# Altium schematic sheet 4.2寸墨水屏-兼容甘草酸不酸_2024-11-22.schdoc
size 344 x 241 mm
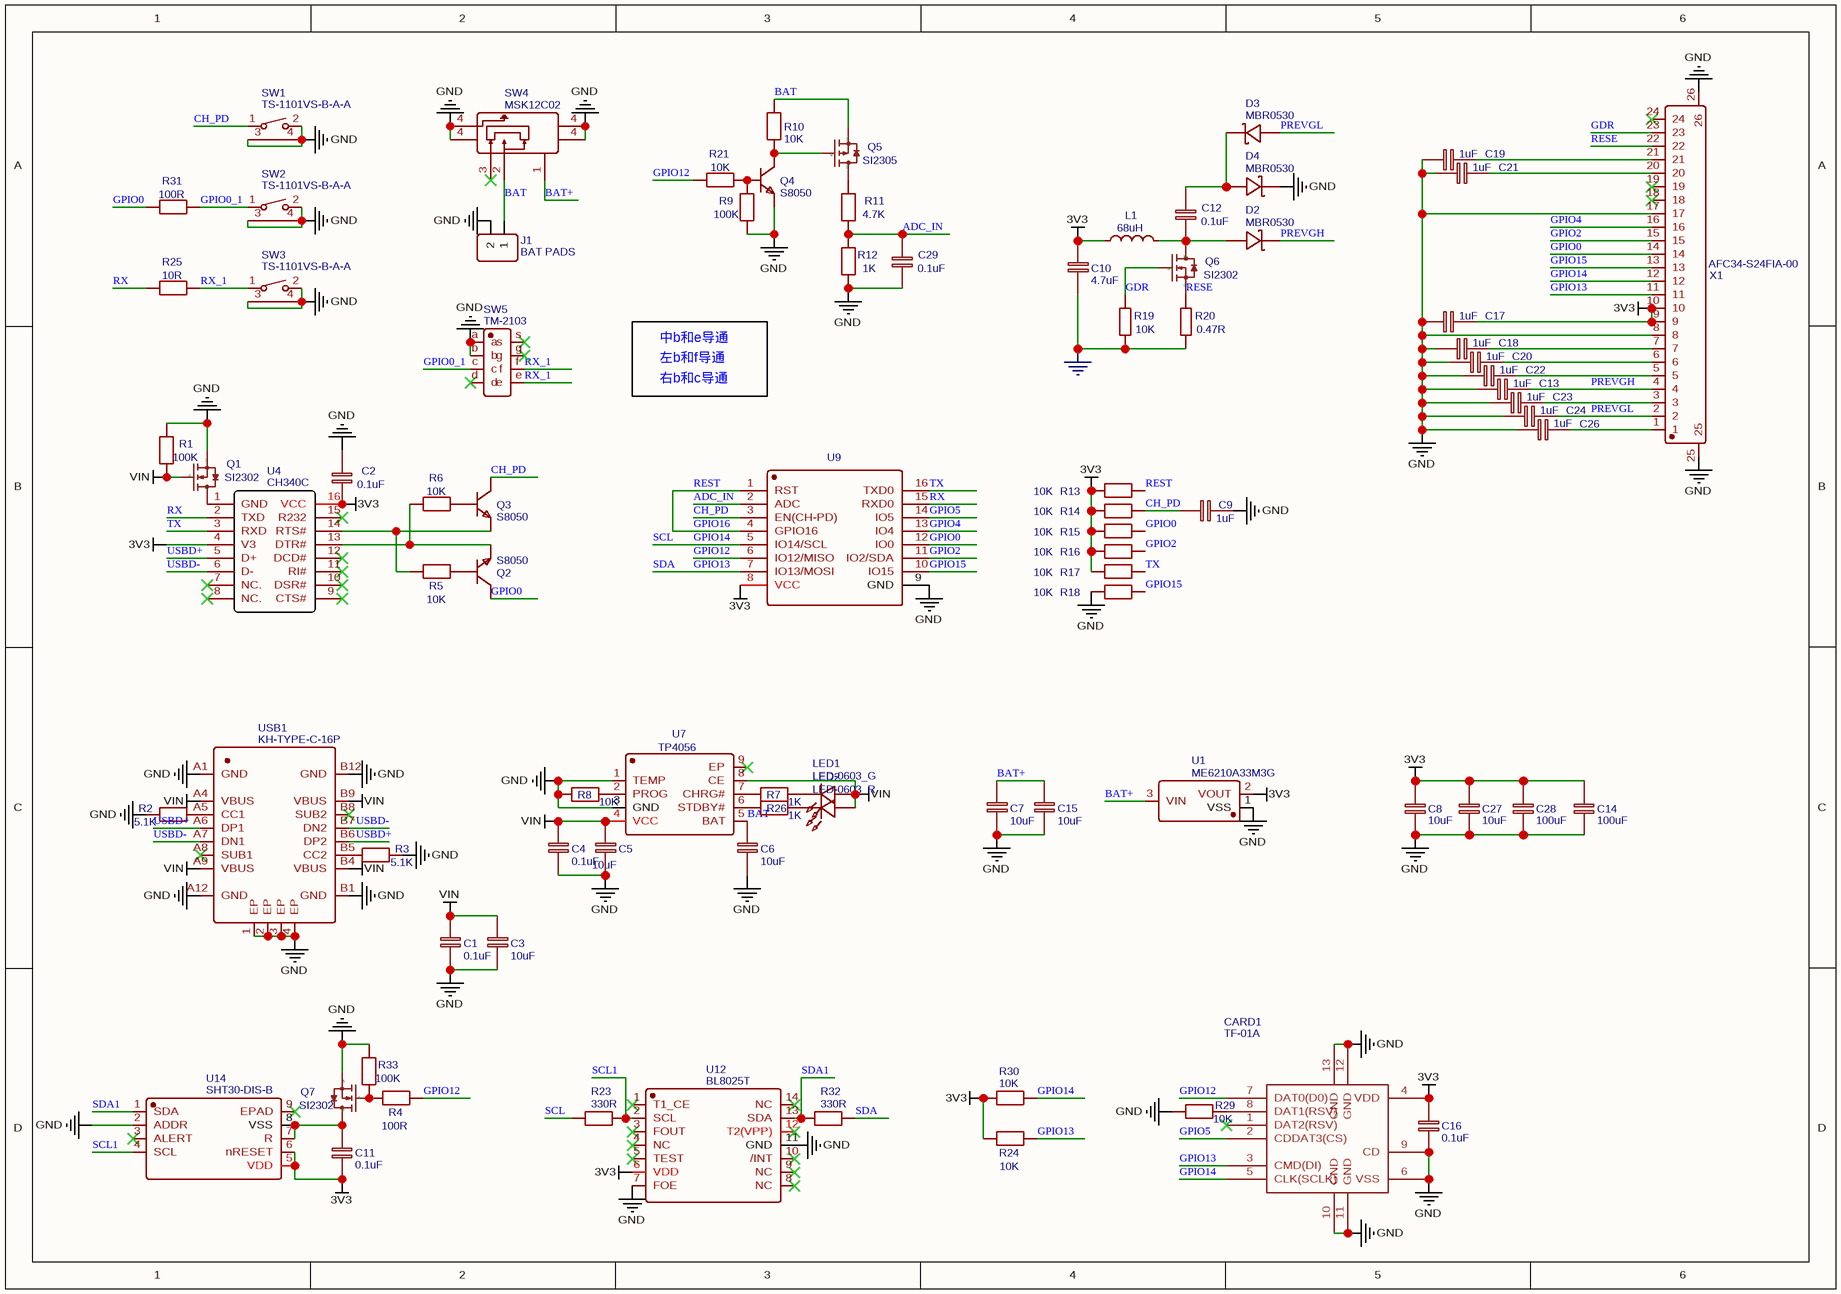
[diagram p0: 4.2寸墨水屏-兼容甘草酸不酸_2024-11-22.schdoc]

## Parts
C1  0.1uF  [C0603]
C2  0.1uF  [C0603]
C3  10uF  [C0603]
C4  0.1uF  [C0603]
C5  10uF  [C0603]
C6  10uF  [C0603]
C7  10uF  [C0603]
C8  10uF  [C0603]
C9  1uF  [C0603]
C10  4.7uF  [C0603]
C11  0.1uF  [C0603]
C12  0.1uF  [C0603]
C13  1uF  [C0603]
C14  100uF  [C1210]
C15  10uF  [C0603]
C16  0.1uF  [C0603]
C17  1uF  [C0603]
C18  1uF  [C0603]
C19  1uF  [C0603]
C20  1uF  [C0603]
C21  1uF  [C0603]
C22  1uF  [C0603]
C23  1uF  [C0603]
C24  1uF  [C0603]
C26  1uF  [C0603]
C27  10uF  [C0603]
C28  100uF  [C1210]
C29  0.1uF  [C0603]
CARD1  TF-01A  [TF-SMD_TF-01A]
D2  MBR0530  [SOD-123]
D3  MBR0530  [SOD-123]
D4  MBR0530  [SOD-123]
J1  BAT PADS  [HDR-F-2.54_1X2]
L1  68uH  [IND-SMD_L3.5-W3.0]
LED1  LED-0603_G  [LED0603_GREEN]
LED2  LED-0603_R  [LED0603_RED]
Q1  SI2302  [SOT-23(SOT-23-3)]
Q2  S8050  [SOT-23-3_L3.0-W1.7-P0.95-LS2.9-BR]
Q3  S8050  [SOT-23-3_L3.0-W1.7-P0.95-LS2.9-BR]
Q4  S8050  [SOT-23-3_L3.0-W1.7-P0.95-LS2.9-BR]
Q5  SI2305  [SOT-23-3_L2.9-W1.3-P1.90-LS2.4-BR]
Q6  SI2302  [SOT-23(SOT-23-3)]
Q7  SI2302  [SOT-23(SOT-23-3)]
R1  100K  [R0603]
R2  5.1K  [R0603]
R3  5.1K  [R0603]
R4  100R  [R0603]
R5  10K  [R0603]
R6  10K  [R0603]
R7  1K  [R0603]
R8  10K  [R0603]
R9  100K  [R0603]
R10  10K  [R0603]
R11  4.7K  [R0603]
R12  1K  [R0603]
R13  10K  [R0603]
R14  10K  [R0603]
R15  10K  [R0603]
R16  10K  [R0603]
R17  10K  [R0603]
R18  10K  [R0603]
R19  10K  [R0603]
R20  0.47R  [R0603]
R21  10K  [R0603]
R23  330R  [R0603]
R24  10K  [R0603]
R25  10R  [R0603]
R26  1K  [R0603]
R29  10K  [R0603]
R30  10K  [R0603]
R31  100R  [R0603]
R32  330R  [R0603]
R33  100K  [R0603]
SW1  TS-1101VS-B-A-A  [SW-SMD_TS-1101VS-C-A-B]
SW2  TS-1101VS-B-A-A  [SW-SMD_TS-1101VS-C-A-B]
SW3  TS-1101VS-B-A-A  [SW-SMD_TS-1101VS-C-A-B]
SW4  MSK12C02  [SW-TH_MSK12C02]
SW5  TM-2103  [SW-SMD_TM-2103]
U1  ME6210A33M3G  [SOT-23-3_L3.0-W1.7-P0.95-LS2.9-BR]
U4  CH340C  [SOP-16_L10.0-W3.9-P1.27-LS6.0-BL]
U7  TP4056  [ESOP-8_L4.9-W3.9-P1.27-LS6.0-BL-EP]
U9  ESP8266模组标注版  [ESP-12]  (value not drawn)
U12  BL8025T  [SOP-14_L10.3-W5.3-P1.27-LS7.8-BL]
U14  SHT30-DIS-B  [DFN-8_L2.5-W2.5-P0.50-BL-EP]
USB1  KH-TYPE-C-16P  [USB-C-SMD_KH-TYPE-C-16P]
X1  AFC34-S24FIA-00  [FPC-SMD_AFC34-S24FIA-00]

## Nets
3V3: C2.1 C8.2 C10.1 C11.1 C14.2 C16.2 C17.2 C27.2 C28.2 CARD1.4(VDD) L1.1 R13.1 R14.1 R15.1 R16.1 R17.1 R24.2 R30.2 U1.2(VOUT) U4.4(V3) U4.16(VCC) U9.8(VCC) U12.6(VDD) U14.5(VDD) U14.6(nRESET) X1.9 X1.10
GND: C1.2 C2.2 C3.2 C4.2 C5.2 C6.2 C7.2 C8.1 C9.2 C10.2 C13.1 C14.1 C15.2 C16.1 C17.1 C18.1 C19.1 C20.1 C21.1 C22.1 C23.1 C24.1 C26.1 C27.1 C28.1 C29.1 CARD1.6(VSS) CARD1.9(CD) CARD1.10(GND) CARD1.11(GND) CARD1.12(GND) CARD1.13(GND) D4.2(K) J1.2 Q1.2(S) Q4.2(E) Q7.2(S) R1.2 R2.1 R3.2 R8.1 R9.1 R12.1 R18.1 R19.1 R20.1 R29.1 R33.2 SW1.2 SW1.3 SW1.4 SW2.2 SW2.3 SW2.4 SW3.2 SW3.3 SW3.4 SW4.4 SW5.a SW5.b U1.1(VSS) U7.1(TEMP) U7.3(GND) U9.9(GND) U12.7(FOE) U12.11(GND) U14.2(ADDR) USB1.1(EP) USB1.2(EP) USB1.3(EP) USB1.4(EP) USB1.A1(GND) USB1.A12(GND) USB1.B1(GND) USB1.B12(GND) X1.8 X1.17 X1.25 X1.26
VIN: C1.1 C3.1 C4.1 C5.1 LED1.1 LED2.1 Q1.1(G) R1.1 U7.4(VCC) U7.8(CE) USB1.A4(VBUS) USB1.A9(VBUS) USB1.B4(VBUS) USB1.B9(VBUS)
ADC_IN: C29.2 R11.1 R12.2 U9.2(ADC)
BAT: C6.1 J1.1 Q5.2(S) R10.2 SW4.2 U7.5(BAT)
BAT+: C7.1 C15.1 SW4.1 U1.3(VIN)
CH_PD: C9.1 Q3.3(C) R14.2 SW1.1 U9.3(EN(CH-PD))
GDR: Q6.1(G) R19.2 X1.23
GPIO0: Q2.3(C) R15.2 R31.1 U9.12(IO0) X1.14
GPIO0_1: R31.2 SW2.1 SW5.c
GPIO2: R16.2 U9.11(IO2/SDA) X1.15
GPIO4: U9.13(IO4) X1.16
GPIO5: CARD1.2(CDDAT3(CS)) U9.14(IO5)
GPIO12: CARD1.7(DAT0(D0)) R4.1 R21.1 U9.6(IO12/MISO)
GPIO13: CARD1.3(CMD(DI)) R24.1 R32.2 U9.7(IO13/MOSI) X1.11  [also labelled SDA]
GPIO14: CARD1.5(CLK(SCLK)) R23.1 R30.1 U9.5(IO14/SCL) X1.12  [also labelled SCL]
GPIO15: R18.2 U9.10(IO15) X1.13
GPIO16: R13.2 U9.1(RST) U9.4(GPIO16)  [also labelled REST]
PREVGH: C13.2 D2.2(K) X1.4
PREVGL: C24.2 D3.1(A) X1.2
RESE: Q6.2(S) R20.2 X1.22
RX: R25.1 U4.2(TXD) U9.15(RXD0)
RX_1: R25.2 SW3.1 SW5.e SW5.f
SCL1: R23.2 U12.2(SCL) U14.4(SCL)
SDA1: R32.1 U12.13(SDA) U14.1(SDA)
TX: R17.2 U4.3(RXD) U9.16(TXD0)
USBD+: U4.5(D+) USB1.A6(DP1) USB1.B6(DP2)
USBD-: U4.6(D-) USB1.A7(DN1) USB1.B7(DN2)
NetC11_2: C11.2 Q7.3(D) U14.7(R) U14.8(VSS)
NetC12_1: C12.1 D2.1(A) L1.2 Q6.3(D)
NetC12_2: C12.2 D3.2(K) D4.1(A)
NetC18_2: C18.2 X1.7
NetC19_2: C19.2 X1.21
NetC20_2: C20.2 X1.6
NetC21_2: C21.2 X1.20
NetC22_2: C22.2 X1.5
NetC23_2: C23.2 X1.3
NetC26_2: C26.2 X1.1
NetCARD1_8: CARD1.8(DAT1(RSV)) R29.2
NetLED1_2: LED1.2 R7.2
NetLED2_2: LED2.2 R26.2
NetQ1_3: Q1.3(D) U4.1(GND)
NetQ2_1: Q2.1(B) R5.2
NetQ2_2: Q2.2(E) R6.1 U4.13(DTR#)
NetQ3_1: Q3.1(B) R6.2
NetQ3_2: Q3.2(E) R5.1 U4.14(RTS#)
NetQ4_1: Q4.1(B) R9.2 R21.2
NetQ4_3: Q4.3(C) Q5.1(G) R10.1
NetQ5_3: Q5.3(D) R11.2
NetQ7_1: Q7.1(G) R4.2 R33.1
NetR2_2: R2.2 USB1.A5(CC1)
NetR3_1: R3.1 USB1.B5(CC2)
NetR7_1: R7.1 U7.7(CHRG#)
NetR8_2: R8.2 U7.2(PROG)
NetR26_1: R26.1 U7.6(STDBY#)

Not connected (* = marked no-connect by the designer): CARD1 1(DAT2(RSV))*; SW4 3*; SW5 d* g* s*; U4 7(NC.)* 8(NC.)* 9(CTS#)* 10(DSR#)* 11(RI#)* 12(DCD#)* 15(R232)*; U7 9(EP)*; U12 1(T1_CE)* 3(FOUT)* 4(NC)* 5(TEST)* 8(NC)* 9(NC)* 10(/INT)* 12(T2(VPP))* 14(NC)*; U14 3(ALERT)* 9(EPAD)*; USB1 A8(SUB1)* B8(SUB2)*; X1 18* 19* 24*

## Notes on the sheet
- 中b和e导通
- 左b和f导通
- 右b和c导通

## Library data of the parts
C1 C2 C4 C11 C12 C16 C29 = 0.1uF: nameAlias: Value(F); Contributor: LCEDA_Lib; spicePre: C; spiceSymbolName: C_0603_EU
C3 C5-C8 C15 C27 = 10uF: nameAlias: Value(F); Contributor: LCEDA_Lib; spicePre: C; spiceSymbolName: C_0603_EU
C9 C13 C17-C24 C26 = 1uF: nameAlias: Value(F); Contributor: LCEDA_Lib; spicePre: C; spiceSymbolName: C_0603_EU
C10 = 4.7uF: Manufacturer Part: CL10A475MP5LNNC; Manufacturer: Samsung Electro-Mechanics; nameAlias: Value(F); spicePre: C; spiceSymbolName: Capacitor; Supplier: LCSC; Supplier Part: C318644
C14 C28 = 100uF: nameAlias: Value(F); Contributor: LCEDA_Lib; spicePre: C; spiceSymbolName: C_1206_EU
CARD1 = TF-01A: Manufacturer: 韩国韩荣; Supplier: LCSC; Manufacturer Part: TF-01A; Supplier Part: C91145; JLCPCB Part Class: Extended Part; spicePre: C; spiceSymbolName: TF-01A
J1 = BAT PADS: Contributor: LCEDA_Lib; Package Display: No; Supplier Part: C49661; Supplier: LCSC; spicePre: H; spiceSymbolName: HDR-F-2.54_1x2
L1 = 68uH: Manufacturer: DMBJ(振宝佳); Manufacturer Part: CD32-680M; Contributor: LCSC; nameAlias: Inductance; Supplier: LCSC; Supplier Part: C2826627; JLCPCB Part Class: Extended Part; spicePre: L; spiceSymbolName: CD32-680M
LED1 = LED-0603_G: Manufacturer: EVERLIGHT(台湾亿光); Manufacturer Part: 19-217/GHC-YR1S2/3T; Contributor: LCEDA_Lib; Supplier Part: C72043; Supplier: LCSC; spicePre: L; spiceSymbolName: LED-0603_G
LED2 = LED-0603_R: Manufacturer: EVERLIGHT(台湾亿光); Manufacturer Part: 19-217/R6C-AL1M2VY/3T; Contributor: LCEDA_01; Supplier Part: C72044; Supplier: LCSC; spicePre: L; spiceSymbolName: LED-0603_R
Q1 Q6 Q7 = SI2302: Manufacturer: Hottech; Contributor: LCSC; SMT Type: Extend; Supplier: LCSC; Manufacturer Part: SI2302; Supplier Part: C181087; LCSC Assembly: Yes; spicePre: Q
Q2-Q4 = S8050: Manufacturer: CJ(江苏长电/长晶); Manufacturer Part: S8050 J3Y; Supplier: LCSC; Supplier Part: C2146; JLCPCB Part Class: Basic Part; spicePre: Q; spiceSymbolName: S8050_C2146
Q5 = SI2305: Manufacturer: Hottech(合科泰); Contributor: LCSC; Supplier: LCSC; Manufacturer Part: SI2305; Supplier Part: C181088; JLCPCB Part Class: Extended Part; spicePre: Q; spiceSymbolName: SI2305
R1 R9 R33 = 100K: nameAlias: Value(Ω); Contributor: LCEDA_Lib; spicePre: R; spiceSymbolName: R_0603_EU
R2 R3 = 5.1K: nameAlias: Value(Ω); Contributor: LCEDA_Lib; spicePre: R; spiceSymbolName: R_0603_EU
R4 R31 = 100R: nameAlias: Value(Ω); Contributor: LCEDA_Lib; spicePre: R; spiceSymbolName: R_0603_EU
R5 R6 R8 R10 R13-R18 R21 R24 R29 R30 = 10K: nameAlias: Value(Ω); Contributor: LCEDA_Lib; spicePre: R; spiceSymbolName: R_0603_EU
R7 R12 R26 = 1K: nameAlias: Value(Ω); Contributor: LCEDA_Lib; spicePre: R; spiceSymbolName: R_0603_EU
R11 = 4.7K: nameAlias: Value(Ω); Contributor: LCEDA_Lib; spicePre: R; spiceSymbolName: R_0603_EU
R19 = 10K: Manufacturer Part: CRCW060310K0JNEA; Manufacturer: Vishay Intertech; nameAlias: Value(Ω); spicePre: R; spiceSymbolName: Resistor; Supplier: LCSC; Supplier Part: C169103
R20 = 0.47R: Manufacturer Part: CR0603F0R47P05; Manufacturer: Ever Ohms Tech; nameAlias: Value(Ω); spicePre: R; spiceSymbolName: Resistor; Supplier: LCSC; Supplier Part: C175657
R23 R32 = 330R: nameAlias: Value(Ω); Contributor: LCEDA_Lib; spicePre: R; spiceSymbolName: R_0603_EU
R25 = 10R: nameAlias: Value(Ω); Contributor: LCEDA_Lib; spicePre: R; spiceSymbolName: R_0603_EU
SW1-SW3 = TS-1101VS-B-A-A: Manufacturer: XKB Enterprise; Contributor: LCSC; Supplier: LCSC; Supplier Part: C561499; Manufacturer Part: TS-1101VS-B-A-A; JLCPCB Part Class: Extended Part; spicePre: S; spiceSymbolName: TS-1101VS-B-A-A
SW4 = MSK12C02: Manufacturer: SHOU HAN; Contributor: LCSC; Supplier: LCSC; Supplier Part: C431540; Manufacturer Part: MSK12C02; JLCPCB Part Class: Extended Part; spicePre: S; spiceSymbolName: MSK12C02
SW5 = TM-2103: Manufacturer: XKB Connectivity(中国星坤); Contributor: LCSC; Supplier: LCSC; Supplier Part: C318947; Manufacturer Part: TM-2103; JLCPCB Part Class: Extended Part; spicePre: S; spiceSymbolName: TM-2103
U1 = ME6210A33M3G: Manufacturer: MICRONE(南京微盟); Contributor: LCSC; Supplier: LCSC; Supplier Part: C236680; Manufacturer Part: ME6210A33M3G; JLCPCB Part Class: Extended Part; spicePre: U; spiceSymbolName: ME6210A33M3G
U4 = CH340C: Manufacturer: WCH(南京沁恒); Supplier: LCSC; Manufacturer Part: CH340C; Supplier Part: C84681; JLCPCB Part Class: Extended Part; spicePre: U; spiceSymbolName: CH340C
U7 = TP4056: Manufacturer: UMW(友台半导体); Contributor: LCSC; Supplier: LCSC; Supplier Part: C725790; Manufacturer Part: TP4056; JLCPCB Part Class: Extended Part; spicePre: U; spiceSymbolName: TP4056_C725790
U9 = ESP8266模组标注版: Contributor: SakuraNeko; spicePre: U; spiceSymbolName: ESP8266模组标注版
U12 = BL8025T: Manufacturer: BL; Supplier: LCSC; Manufacturer Part: BL8025T; Supplier Part: C79083; JLCPCB Part Class: Extended Part; spicePre: U; spiceSymbolName: BL8025T
U14 = SHT30-DIS-B: Manufacturer: Sensirion(瑞士盛思锐); Manufacturer Part: SHT30-DIS-B2.5KS; Supplier: LCSC; Supplier Part: C77361; JLCPCB Part Class: Extended Part; spicePre: U; spiceSymbolName: SHT30-DIS-B
USB1 = KH-TYPE-C-16P: Manufacturer: kinghelm(金航标); Contributor: LCSC; Supplier: LCSC; Supplier Part: C709357; Manufacturer Part: KH-TYPE-C-16P; JLCPCB Part Class: Extended Part; spicePre: U; spiceSymbolName: KH-TYPE-C-16P
X1 = AFC34-S24FIA-00: Manufacturer: JS(钜硕电子); Contributor: LCSC; Supplier: LCSC; Supplier Part: C2842527; Manufacturer Part: AFC34-S24FIA-00; JLCPCB Part Class: Extended Part; spicePre: X; spiceSymbolName: AFC34-S24FIA-00
D2-D4 = MBR0530: Supplier: LCSC; Manufacturer Part: MBR0530; spicePre: D; Supplier Part: C77336